# EAGLE design Voltage_200519 (EAGLE 7.7.0)
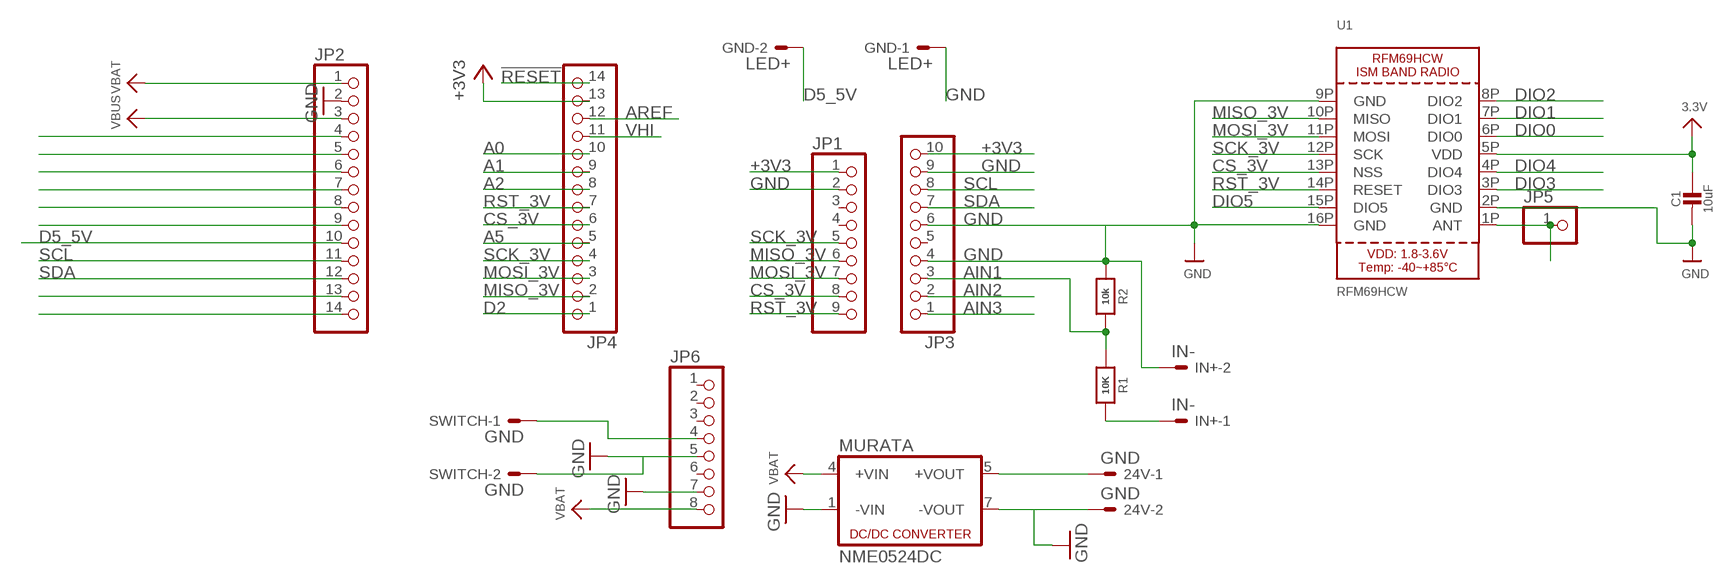
[diagram p0: schematic, sheet 1]

## Parts
24V  GND  332-02  [332-02]
C1  10uF  CAP_CERAMIC0805-NOOUTLINE  [0805-NO@1]
GND  LED+  332-02  [332-02]
IN+  IN-  332-02  [332-02]
JP1  HEADER-1X970MIL  [1X09_ROUND_70]
JP2  HEADER-1X14  [1X14_ROUND70]
JP3  HEADER-1X1070MIL  [1X10_ROUND70]
JP4  HEADER-1X14  [1X14_ROUND70]
JP5  HEADER-1X1ROUND  [1X01_ROUND]
JP6  HEADER-1X8ROUND  [1X08_ROUND]
MURATA  NME0524DC  VA-1212D1  [8DIL-4]
R1  10K  RESISTOR0805_NOOUTLINE  [0805-NO]
R2  10k  RESISTOR0805_NOOUTLINE  [0805-NO]
SWITCH  GND  332-02  [332-02]
U1  RFM69HCW  RFM69HCW_SMT  [RFMHCW_SMT]

## Nets
!RESET: JP4.14
+3V3: C1.1 JP1.1 JP3.10 JP4.13 U1.5P(VDD) ; supply symbol labelled 3.3V
A0: JP4.10
A1: JP4.9
A2: JP4.8
A5: JP4.5
AIN1: JP3.3 R1.1 R2.2
AIN2: JP3.2
AIN3: JP3.1
AREF: JP4.12
CS_3V: JP1.8 JP4.6 U1.13P(NSS)
D2: JP4.1
D5_5V: GND.2 JP2.10
D7: JP2.9
D9: JP2.8
D10: JP2.7
D11: JP2.6
D12: JP2.5
D13: JP2.4
DIO0: U1.6P(DIO0)
DIO1: U1.7P(DIO1)
DIO2: U1.8P(DIO2)
DIO3: U1.3P(DIO3)
DIO4: U1.4P(DIO4)
DIO5: U1.15P(DIO5)
GND: 24V.2 C1.2 GND.1 IN+.2 JP1.2 JP2.2 JP3.4 JP3.6 JP3.9 JP6.5 JP6.7 MURATA.1(-VIN) MURATA.7(-VOUT) R2.1 SWITCH.2 U1.2P(GND) U1.9P(GND) U1.16P(GND)
MISO_3V: JP1.6 JP4.2 U1.10P(MISO)
MOSI_3V: JP1.7 JP4.3 U1.11P(MOSI)
N$1: JP5.1 U1.1P(ANT)
N$2: JP6.4 SWITCH.1
N$3: IN+.1 R1.2
N$4: 24V.1 MURATA.5(+VOUT)
RST_3V: JP1.9 JP4.7 U1.14P(RESET)
RX_D0: JP2.14
SCK_3V: JP1.5 JP4.4 U1.12P(SCK)
SCL: JP2.11 JP3.8
SDA: JP2.12 JP3.7
TX_D1: JP2.13
VBAT: JP2.1 JP6.8 MURATA.4(+VIN)
VBUS: JP2.3
VHI: JP4.11
Unconnected: JP1.3 JP1.4 JP3.5 JP6.1 JP6.2 JP6.3 JP6.6

## Library data of the parts
24V GND IN+ SWITCH = con-garry:332-02: 2 Pin - 2mm Dual Row Source: www.mpe-connector.de / garry_shortform_2012.pdf
C1 = microbuilder:CAP_CERAMIC: Ceramic Capacitors For new designs, use the packages preceded by an '_' character since they are more reliable: The following footprints should be used on most boards: _0402 - Standard footprint for regular board layouts _0603 - Standard footprint for regular board layouts _0805 - Standard footprint for regular board layouts _1206 - Standard footprint for regular board layouts For extremely tight-pitch boards where space is at a premium, the following 'micro-pitch' footprints can be used (smaller pads, no silkscreen outline, etc.): _0402MP - Micro-pitch footprint for very dense/compact boards _0603MP - Micro-pitch footprint for very dense/compact boards _0805MP - Micro-pitch footprint for very dense/compact boards _1206MP - Micro-pitch footprint for very dense/compact boards
JP1 = microbuilder:HEADER-1X9: PIN HEADER
JP2 JP4 = microbuilder:HEADER-1X14
JP3 = microbuilder:HEADER-1X10: PIN HEADER
JP5 = microbuilder:HEADER-1X1: PIN HEADER
JP6 = microbuilder:HEADER-1X8: PIN HEADER
MURATA = dc-dc-converter:VA-*?: DC DC Converter Single Output, 1 Watt Motien Technology Co.,Ltd. Source: Data sheet <http://www.motien.com.tw/data_sheet/VA-1%28H%29.pdf>; OC_FARNELL: unknown; OC_NEWARK: unknown
R1 R2 = microbuilder:RESISTOR: Resistors For new designs, use the packages preceded by an '_' character since they are more reliable: The following footprints should be used on most boards: _0402 - Standard footprint for regular board layouts _0603 - Standard footprint for regular board layouts _0805 - Standard footprint for regular board layouts _1206 - Standard footprint for regular board layouts For extremely tight-pitch boards where space is at a premium, the following 'micro-pitch' footprints can be used (smaller pads, no silkscreen outline, etc.): _0402MP - Micro-pitch footprint for very dense/compact boards _0603MP - Micro-pitch footprint for very dense/compact boards _0805MP - Micro-pitch footprint for very dense/compact boards _1206MP - Micro-pitch footprint for very dense/compact boards
U1 = microbuilder:RFM69HCW: RFM69HCW - ISM Band RF Transceiver

## Board
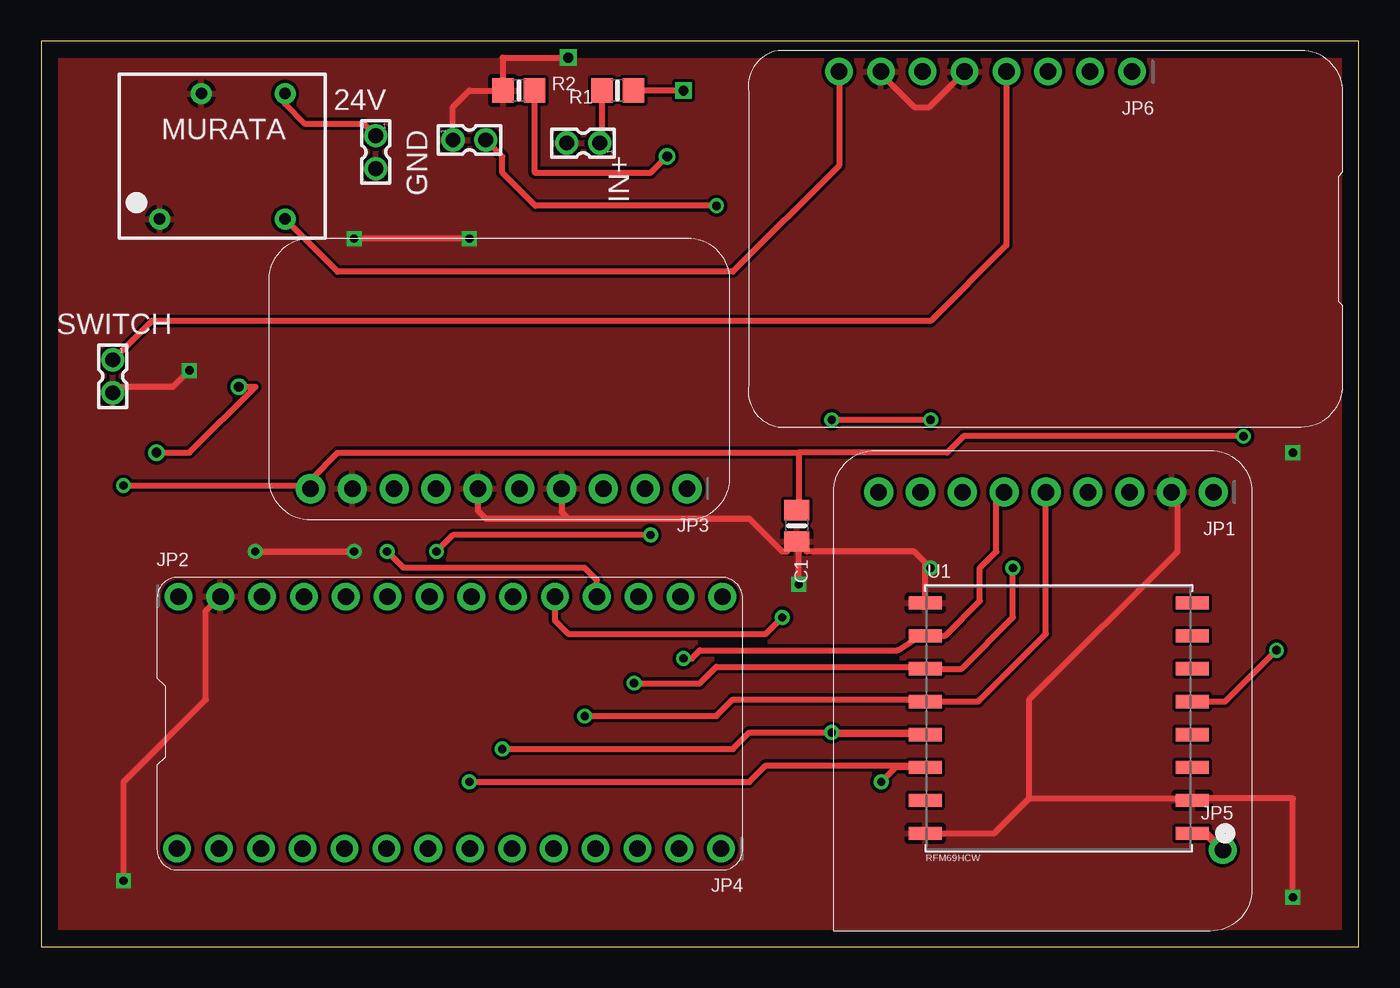
[diagram p1: board, top side]
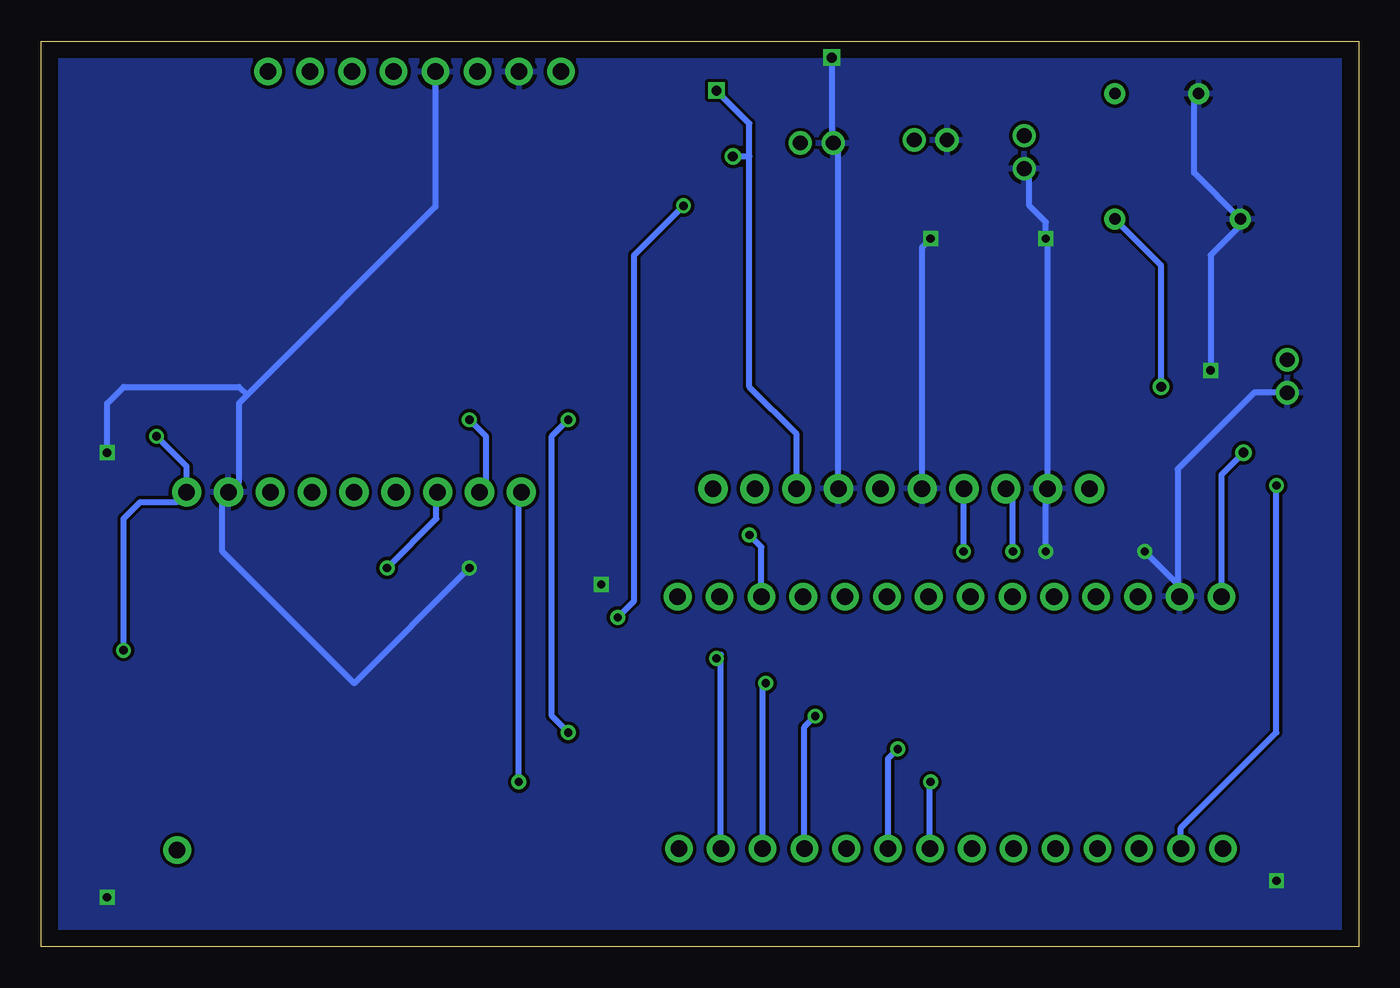
[diagram p2: board, bottom side, seen from below]

Size 80 x 55 mm. Coordinates in mm from the lower left corner, seen from the top.
Outline: 0,55 0,0 80,0 80,55 0,55
Copper layers (1*16): Top 0.035mm / dielectric 1.5mm / Bottom 0.035mm
Design rules "default *": minimum track width 10mil, minimum drill 24mil, track to track 8mil, track to pad 8mil, pad to pad 8mil, via to via 8mil, smd to smd 8mil, copper to edge 40mil, drill to drill 8mil, minimum pad ring 10mil, minimum via ring 8mil, stop-mask expansion 4mil, vias tented up to drill 0mil, thermal gap 10mil

### Footprints (pad centres in the part's own frame; a part is rotated, then mirrored left to right if it is on the bottom)
332-02 = drill 0.9 pad 1.27: 1 0,-1; 2 0,1
0805-NO@1 = smd 1.24 x 1.5: 1 -0.95,0; 2 0.95,0
1X09_ROUND_70 = drill 1 pad 1.778: 1 -10.16,0; 2 -7.62,0; 3 -5.08,0; 4 -2.54,0; 5 0,0; 6 2.54,0; 7 5.08,0; 8 7.62,0; 9 10.16,0
1X14_ROUND70 = drill 1 pad 1.676: 1 -16.51,0; 2 -13.97,0; 3 -11.43,0; 4 -8.89,0; 5 -6.35,0; 6 -3.81,0; 7 -1.27,0; 8 1.27,0; 9 3.81,0; 10 6.35,0; 11 8.89,0; 12 11.43,0; 13 13.97,0; 14 16.51,0
1X10_ROUND70 = drill 1 pad 1.778: 1 -11.43,0; 2 -8.89,0; 3 -6.35,0; 4 -3.81,0; 5 -1.27,0; 6 1.27,0; 7 3.81,0; 8 6.35,0; 9 8.89,0; 10 11.43,0
1X01_ROUND = drill 1 pad 1.676: 1 0,0
1X08_ROUND = drill 1 pad 1.676: 1 -8.89,0; 2 -6.35,0; 3 -3.81,0; 4 -1.27,0; 5 1.27,0; 6 3.81,0; 7 6.35,0; 8 8.89,0
8DIL-4 = drill 0.7 pad 1.27: 1 -3.81,-3.81; 4 3.81,-3.81; 5 3.81,3.81; 7 -1.27,3.81
0805-NO = smd 1.3 x 1.5: 1 -0.95,0; 2 0.95,0
RFMHCW_SMT = smd 2 x 0.8: 1P 8.1,-7; 2P 8.1,-5; 3P 8.1,-3; 4P 8.1,-1; 5P 8.1,1; 6P 8.1,3; 7P 8.1,5; 8P 8.1,7; 9P -8.1,7; 10P -8.1,5; 11P -8.1,3; 12P -8.1,1; 13P -8.1,-1; 14P -8.1,-3; 15P -8.1,-5; 16P -8.1,-7

### Placement (x,y rotation side)
24V  20.32,48.26 180 top
C1  45.88,25.56 270 top
GND  26,49 270 top
IN+  32.91,48.81 90 top
JP1  61.01,27.61 180 top
JP2  24.84,21.26 0 top
JP3  27.78,27.81 180 top
JP4  24.77,5.94 180 top
JP5  71.74,5.86 0 top
JP6  57.33,53.15 180 top
MURATA  11,48 0 top
R1  35,52 180 top
R2  29,52 0 top
SWITCH  4.34,34.64 180 top
U1  61.78,13.88 0 top

### Tracks (layer width: path | path; a pad name or v marks a point on that pad's centre or on a via)
+3V3  (via drill 0.5)
  Top 0.35: v5,28 16.17,28 JP3.10 16.35,28.35 18,30 46,30 | U1.5P 71.88,14.88 v75,18 | v73,31 56,31 55,30 46,30 | 46,30 46,26.63 C1.1
  Bottom 0.35: JP4.13 10.8,7.2 5,13 v5,28 | v75,18 75,26 74,27 71.77,27 JP1.1 71.17,29.17 v73,31
AIN1  (via drill 0.6)
  Top 0.35: v39,52 R1.1 | R2.2 29.95,47.05 30,47 37,47 v38,48
  Bottom 0.35: JP3.3 34.13,31.13 37,34 37,48 | 37,48 37,50 v39,52 | v38,48 37,48
CS_3V  (via drill 0.5)
  Top 0.35: v28,12 42,12 43,13 v48,13 | v48,13 53.56,13 U1.13P 48.12,12.88 v48,13 | v48,32 v54,32
  Bottom 0.35: JP4.6 28.58,11.42 v28,12 | v48,13 49,14 49,31 v48,32 | v54,32 53,31 53,27.99 JP1.8
D5_5V  (via drill 0.5)
  Top 0.35: JP2.10 31.19,19.81 32,19 44,19 v45,20 | v41,45 30,45 28,47 28,48 GND.2
  Bottom 0.35: v45,20 44,21 44,42 v41,45
GND  (via drill 0.5, 0.6)
  Top 0.35: U1.16P 57.88,6.88 60,9 | 60,9 69.76,9 U1.2P 70,9 76,9 v76,3 | 46.24,24.25 46.49,24 53,24 53.68,23.32 U1.9P 53.68,22.68 v54,23 | 46.24,24.25 C1.2 45.27,24 45,24 43,26 32,26 | v13,24 v19,24 | v26,43 v19,43 | JP6.7 50.98,53.02 53,51 53.91,51 JP6.5 | JP3.6 26.51,26.49 27,26 32,26 | 60,9 60,15 69,24 69,27.23 JP1.2 68.12,28.12 | JP3.4 31.59,26.41 32,26 | v9,35 8,34 4.7,34 SWITCH.2 | v5,4 5,10 10,15 10,20.38 JP2.2 | GND.1 25,51 26,52 R2.1 28.05,53.95 28,54 v32,54 | v46,22 46,24 46.24,24.25
  Bottom 0.35: v54,23 61,16 69,24 69,27.23 JP1.2 68,28.23 68,33 67.5,33.5 | JP6.5 56.06,44.94 67.5,33.5 | SWITCH.2 6.36,33.64 11,29 11,21.38 JP2.2 10.87,21.87 v13,24 | v19,24 19,27.71 JP3.9 18.89,43 v19,43 19,44 20,45 20,46.94 24V.2 | JP3.6 26.51,42.49 v26,43 | JP3.4 31.59,48.5 IN+.2 32,48.91 v32,54 | v76,30 76,33 75,34 68,34 67.5,33.5 | v9,35 9,42 7,44 MURATA.1 10,47 10,51.54 MURATA.7
  pour Top: 0,0 80,0 80,5 80,55 0,55 0,50
  pour Bottom: 0,0 80,0 80,5 80,55 0,55 0,50
MISO_3V  (via drill 0.5)
  Top 0.35: JP1.6 58,27.14 58,24 57,23 57,21 54.88,18.88 U1.10P 53.56,19 52,18 40,18 39.5,17.5 v39,17.5
  Bottom 0.35: JP4.2 38.74,17.74 v39,17.5
MOSI_3V  (via drill 0.5)
  Top 0.35: v36,16 40,16 41,17 53.56,17 U1.11P 55.88,16.88 59,20 v59,23
  Bottom 0.35: JP4.3 36.2,15.8 v36,16 | v59,23 56,26 56,27.53 JP1.7
N$1
  Top 0.5: U1.1P 70.72,6.88 JP5.1
N$2
  Top 0.35: JP6.4 58.6,42.6 54,38 6.7,38 SWITCH.1
N$3
  Top 0.35: R1.2 34.05,48.96 IN+.1
N$4
  Top 0.35: MURATA.5 14.81,51.19 16,50 19.58,50 24V.1
RST_3V  (via drill 0.5)
  Top 0.35: v26,10 43,10 44,11 53.56,11 U1.14P 51.88,10.88 v51,10
  Bottom 0.35: JP4.7 26.04,9.96 v26,10 | v51,10 51,27.45 JP1.9
SCK_3V  (via drill 0.5)
  Top 0.35: v33,14 41,14 42,15 53.56,15 U1.12P 56.88,14.88 61,19 JP1.5
  Bottom 0.35: JP4.4 33.66,13.34 v33,14
SCL  (via drill 0.5)
  Top 0.35: JP2.11 33.73,22.27 33,23 22,23 v21,24
  Bottom 0.35: v21,24 21,27.38 JP3.8
SDA  (via drill 0.5)
  Top 0.35: v37,25 25,25 v24,24
  Bottom 0.35: JP2.12 36.27,24.27 v37,25 | v24,24 24,27.79 JP3.7
VBAT  (via drill 0.6)
  Top 0.35: JP6.8 48.44,47.44 42,41 18,41 MURATA.4 | v7,30 9,30 13,34 v12,34
  Bottom 0.35: JP2.1 8.33,28.67 v7,30 | v12,34 12,41.38 MURATA.4